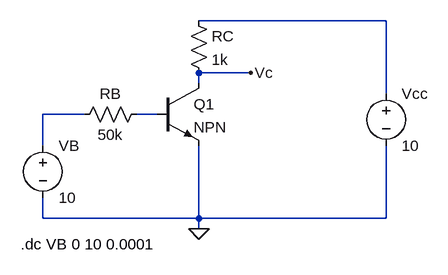
[diagram p0: schematic 1.1_exs.asc]
1.1_exs.asc, the LTspice schematic file:
Version 4
SHEET 1 880 680
WIRE 432 0 144 0
WIRE 224 80 144 80
WIRE 144 96 144 80
WIRE 432 112 432 0
WIRE -32 144 -96 144
WIRE 80 144 48 144
WIRE -96 192 -96 144
WIRE -96 304 -96 272
WIRE 144 304 144 192
WIRE 144 304 -96 304
WIRE 432 304 432 192
WIRE 432 304 144 304
WIRE 144 320 144 304
FLAG 144 320 0
FLAG 224 80 Vc
SYMBOL npn 80 96 R0
SYMATTR InstName Q1
SYMBOL res -48 160 R270
WINDOW 0 32 56 VTop 2
WINDOW 3 0 56 VBottom 2
SYMATTR InstName RB
SYMATTR Value 50k
SYMBOL res 128 -16 R0
SYMATTR InstName RC
SYMATTR Value 1k
SYMBOL voltage 432 96 R0
SYMATTR InstName Vcc
SYMATTR Value 10
SYMBOL voltage -96 176 R0
SYMATTR InstName VB
SYMATTR Value 10
TEXT -130 344 Left 2 !.dc VB 0 10 0.0001

The netlist it stands for:
* 1.1_exs.asc
Q1 Vc N003 0 0 NPN
RB N002 N003 50k
RC N001 Vc 1k
Vcc N001 0 10
VB N002 0 10
.model NPN NPN
.model PNP PNP
.lib standard.bjt
.dc VB 0 10 0.0001
.backanno
.end